# EAGLE design Reflow Panel Rev B (EAGLE 7.6.0)
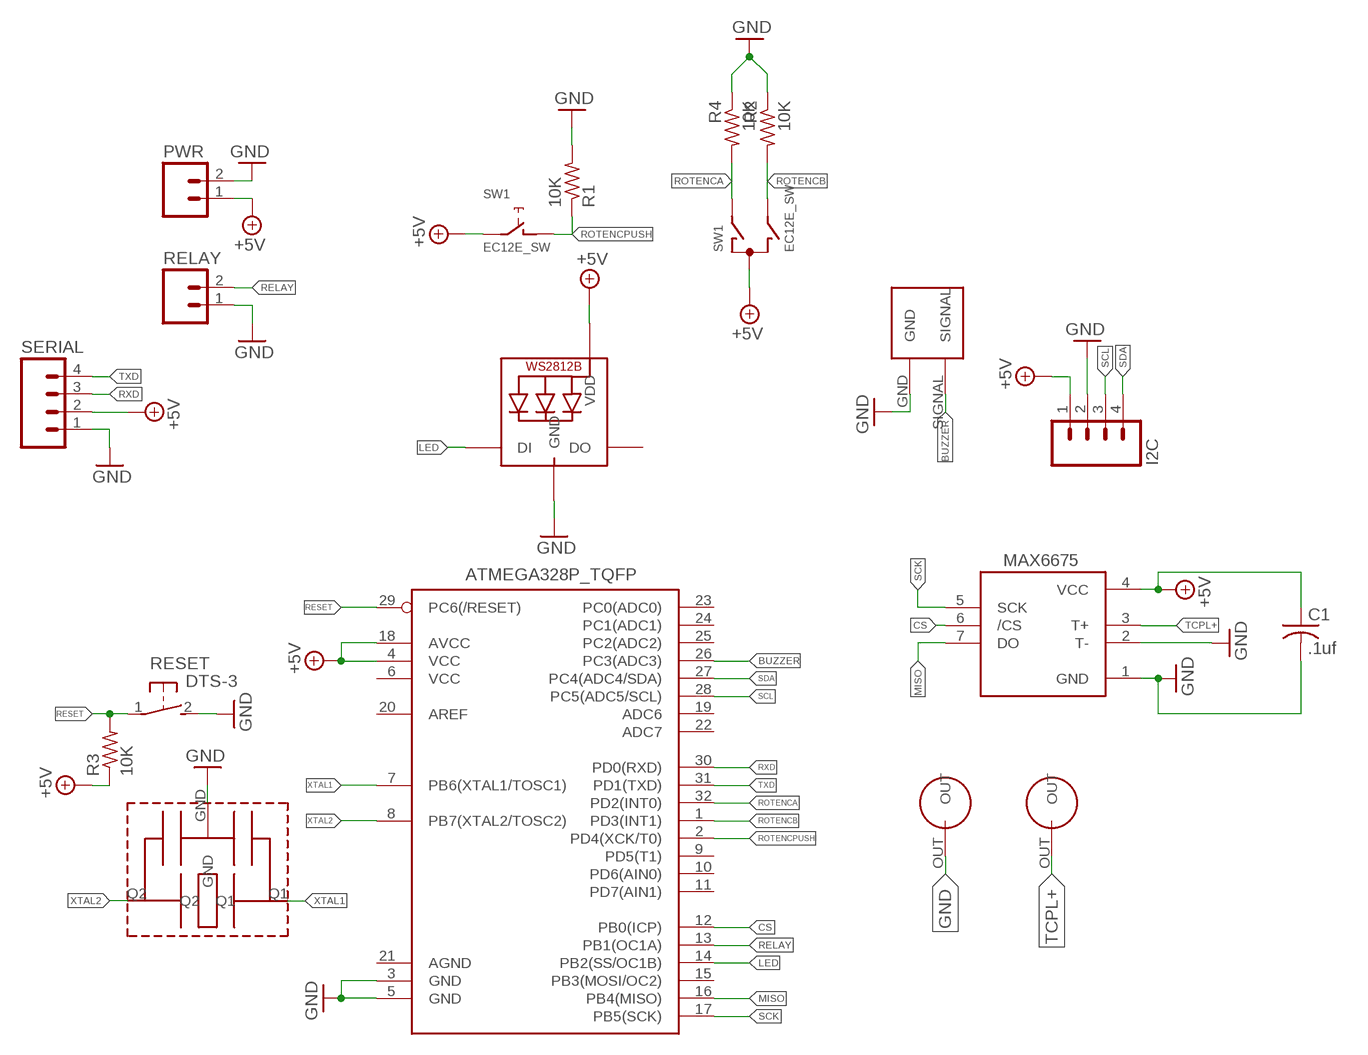
[diagram p0: schematic, sheet 1]

## Parts
C1  .1uf  C-USC0805  [C0805]
I2C  M04LOCK_LONGPADS  [1X04_LOCK_LONGPADS]
IC2  MAX6675  [SO08]
LED1  WS2812B5050  [WS2812B]
PWR  M02LOCK  [1X02_LOCK]
R1  10K  R-US_M0805  [M0805]
R2  10K  R-US_M0805  [M0805]
R3  10K  R-US_M0805  [M0805]
R4  10K  R-US_M0805  [M0805]
RELAY  M02LOCK  [1X02_LOCK]
RESET  DTS-3  [DTS-3]
SERIAL  M04LOCK_LONGPADS  [1X04_LOCK_LONGPADS]
SW1  EC12E_SW  [ALPS_EC12E_SW]
U1  ATMEGA328P_TQFP  [TQFP32-08]
U$1  8.5MMSQUAREBUZZER  [8.5MMSQUAREBUZZER]
U$2  CSTCE16M0V53-R0  [CSTCE_V13C]
U$3  BANANAFEMALE  [BANANAFEMALE]
U$4  BANANAFEMALE  [BANANAFEMALE]

## Nets
+5V: C1.1 I2C.1 IC2.4(VCC) LED1.1-VDD(VDD) PWR.1 R3.1 SERIAL.2 SW1.C SW1.E U1.4(VCC) U1.18(AVCC)
BUZZER: U1.26(PC3(ADC3)) U$1.SIGNAL
CS: IC2.6(/CS) U1.12(PB0(ICP))
GND: C1.2 I2C.2 IC2.1(GND) IC2.2(T-) LED1.3-GND(GND) PWR.2 R1.2 R2.1 R4.1 RELAY.1 RESET.2 SERIAL.1 U1.3(GND) U1.5(GND) U$1.GND U$2.GND U$3.OUT
LED: LED1.4-DIN(DI) U1.14(PB2(SS/OC1B))
MISO: IC2.7(DO) U1.16(PB4(MISO))
RELAY: RELAY.2 U1.13(PB1(OC1A))
RESET: R3.2 RESET.1 U1.29(PC6(/RESET))
ROTENCA: R4.2 SW1.A U1.32(PD2(INT0))
ROTENCB: R2.2 SW1.B U1.1(PD3(INT1))
ROTENCPUSH: R1.1 SW1.D U1.2(PD4(XCK/T0))
RXD: SERIAL.3 U1.30(PD0(RXD))
SCK: IC2.5(SCK) U1.17(PB5(SCK))
SCL: I2C.3 U1.28(PC5(ADC5/SCL))
SDA: I2C.4 U1.27(PC4(ADC4/SDA))
TCPL+: IC2.3(T+) U$4.OUT
TXD: SERIAL.4 U1.31(PD1(TXD))
XTAL1: U1.7(PB6(XTAL1/TOSC1)) U$2.Q1
XTAL2: U1.8(PB7(XTAL2/TOSC2)) U$2.Q2
Unconnected: LED1.2-DOUT(DO) SW1.GND1(G) SW1.GND2(G) U1.6(VCC) U1.9(PD5(T1)) U1.10(PD6(AIN0)) U1.11(PD7(AIN1)) U1.15(PB3(MOSI/OC2)) U1.19(ADC6) U1.20(AREF) U1.21(AGND) U1.22(ADC7) U1.23(PC0(ADC0)) U1.24(PC1(ADC1)) U1.25(PC2(ADC2))

## Library data of the parts
C1 = rcl:C-US: CAPACITOR, American symbol
I2C SERIAL = User-Submitted:M04: Header 4 Standard 4-pin 0.1" header. Use with straight break away headers (SKU : PRT-00116), right angle break away headers (PRT-00553), swiss pins (PRT-00743), machine pins (PRT-00117), and female headers (PRT-00115). Molex polarized connector foot print use with SKU : PRT-08231 with associated crimp pins and housings. 1MM SMD Version SKU: PRT-10208
IC2 = adafruit:MAX6675
LED1 = adafruit:WS2812B
PWR RELAY = SparkFun-Connectors:M02: Standard 2-pin 0.1" header. Use with - straight break away headers ( PRT-00116) - right angle break away headers (PRT-00553) - swiss pins (PRT-00743) - machine pins (PRT-00117) - female headers (PRT-00115) Molex polarized connector foot print use with: PRT-08233 with associated crimp pins and housings. 2.54_SCREWTERM for use with PRT-10571. 3.5mm Screw Terminal footprints for PRT-08084 5mm Screw Terminal footprints for use with PRT-08432
R1-R4 = rcl:R-US_: RESISTOR, American symbol
RESET = switch-tact:DTS-3
SW1 = switch-alps:EC12E_SW: ALPS rotary Encoder EC12E series with switch; MPN: EC12E2424407; OC_FARNELL: 1520813; OC_NEWARK: 74M1068
U1 = SparkFun-DigitalIC:ATMEGA328P_TQFP; PROD_ID: IC-09069
U$1 = custom:8.5MMSQUAREBUZZER
U$2 = custom:CSTCE16M0V53-R0
U$3 U$4 = custom:BANANAFEMALE

## Board
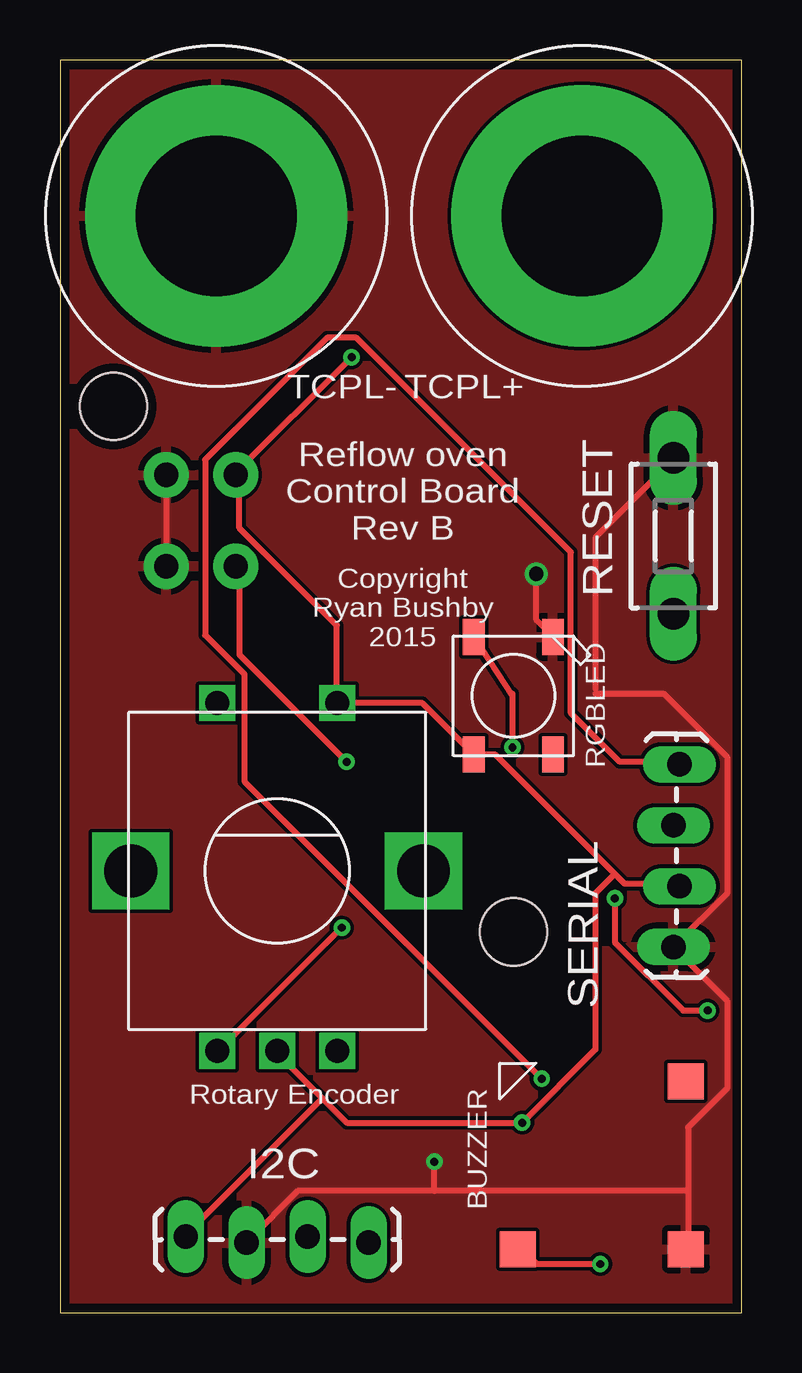
[diagram p1: board, top side]
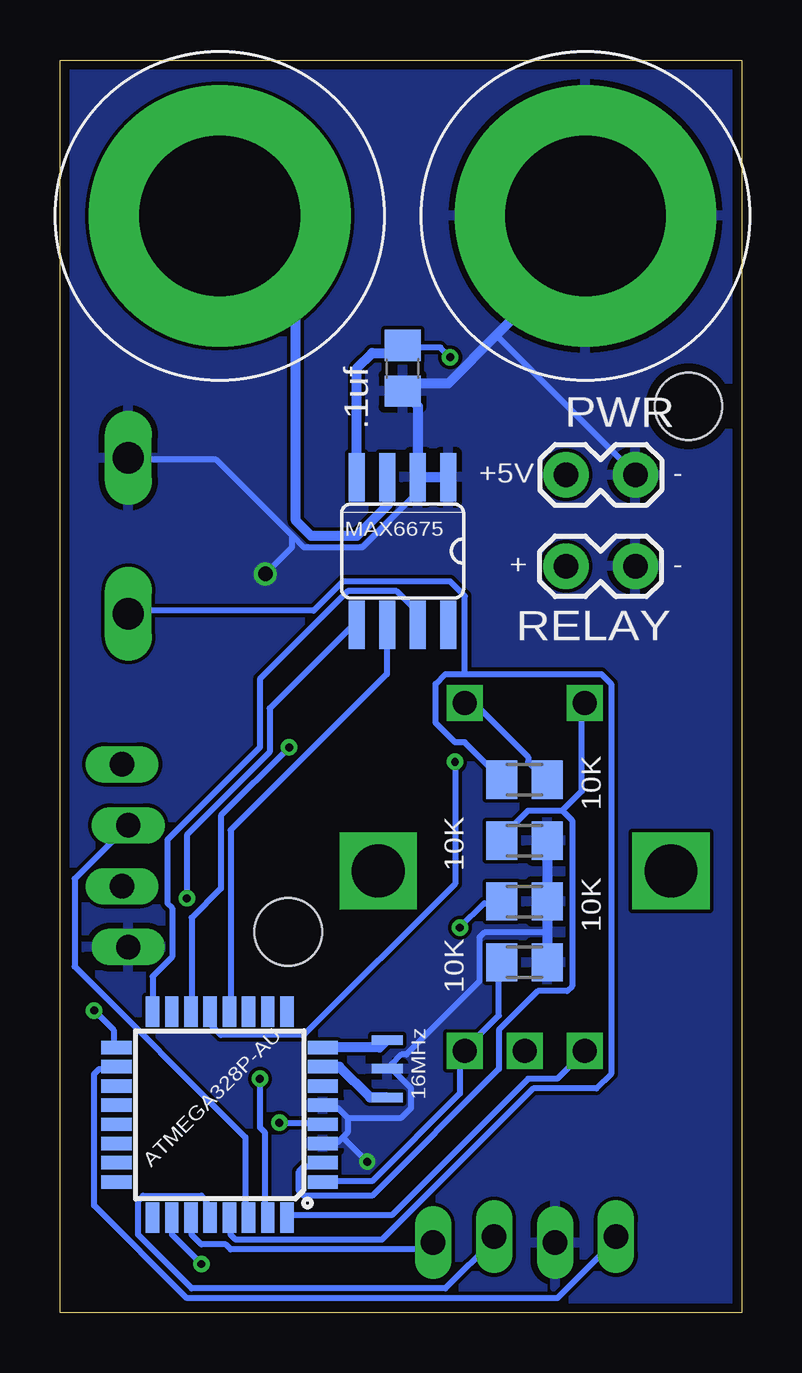
[diagram p2: board, bottom side, seen from below]

Size 28.4 x 52.22 mm. Coordinates in mm from the lower left corner, seen from the top.
Outline: 0,0 28.4,0 28.4,52.22 0,52.22 0,0
Copper layers (1*16): Top 0.0356mm / dielectric 1.5011mm / Bottom 0.0356mm
Design rules "LaenPCBOrder *": minimum track width 10mil, minimum drill 13mil, track to track 6mil, track to pad 6mil, pad to pad 6mil, via to via 6mil, smd to smd 6mil, copper to edge 15mil, drill to drill 6mil, minimum pad ring 7mil, minimum via ring 7mil, stop-mask expansion 3mil, vias tented up to drill 0mil, thermal gap 10mil
Holes 2.8 mm at 2.22,37.78 18.89,15.88

### Footprints (pad centres in the part's own frame; a part is rotated, then mirrored left to right if it is on the bottom)
C0805 = smd 1.3 x 1.5: 1 -0.95,0; 2 0.95,0
1X04_LOCK_LONGPADS = drill 1.016 long: 1 0,0; 2 2.54,-0.254; 3 5.08,0; 4 7.62,-0.254
SO08 = smd 0.66 x 2.032: 1 -1.905,-3.073; 2 -0.635,-3.073; 3 0.635,-3.073; 4 1.905,-3.073; 5 1.905,3.073; 6 0.635,3.073; 7 -0.635,3.073; 8 -1.905,3.073
WS2812B = smd 1.5 x 0.9: 1-VDD 2.45,-1.65; 2-DOUT 2.45,1.65; 3-GND -2.45,1.65; 4-DIN -2.45,-1.65
1X02_LOCK = drill 1.016 pad 1.88: 1 -0.178,0; 2 2.718,0
M0805 = smd 1.3 x 1.6: 1 -0.95,0; 2 0.95,0
DTS-3 = drill 1.3 long: 1 -3.25,0; 2 3.25,0
ALPS_EC12E_SW = drill 1 square: A -2.5,-7.5; B 2.5,-7.5; C 0,-7.5; D -2.5,7; E 2.5,7 | drill 2.2 square: GND1 -6.1,0; GND2 6.1,0
TQFP32-08 = smd 1.27 x 0.559: 1 -4.293,2.8; 2 -4.293,2; 3 -4.293,1.2; 4 -4.293,0.4; 5 -4.293,-0.4; 6 -4.293,-1.2; 7 -4.293,-2; 8 -4.293,-2.8; 17 4.293,-2.8; 18 4.293,-2; 19 4.293,-1.2; 20 4.293,-0.4; 21 4.293,0.4; 22 4.293,1.2; 23 4.293,2; 24 4.293,2.8 | smd 0.559 x 1.27: 9 -2.8,-4.293; 10 -2,-4.293; 11 -1.2,-4.293; 12 -0.4,-4.293; 13 0.4,-4.293; 14 1.2,-4.293; 15 2,-4.293; 16 2.8,-4.293; 25 2.8,4.293; 26 2,4.293; 27 1.2,4.293; 28 0.4,4.293; 29 -0.4,4.293; 30 -1.2,4.293; 31 -2,4.293; 32 -2.8,4.293
8.5MMSQUAREBUZZER = smd 1.5 x 1.5: GND 8.14,0.75; P$3 8.14,7.75; SIGNAL 1.14,0.75
CSTCE_V13C = smd 0.4 x 1.3: GND 0.01,0.01; Q1 -1.19,0.01; Q2 1.21,0.01
BANANAFEMALE = drill 6.7 pad 10.9: OUT 0,0

### Placement (x,y rotation side)
C1  14.13,39.37 270 bottom
I2C  5.24,3.17 0 top
IC2  14.13,31.75 180 bottom
LED1  18.89,25.72 270 top
PWR  7.14,34.92 0 bottom
R1  9.05,19.68 0 bottom
R2  9.05,14.61 180 bottom
R3  9.05,22.23 180 bottom
R4  9.05,17.14 180 bottom
RELAY  4.6,31.11 180 bottom
RESET  25.56,32.38 90 top
SERIAL  25.56,15.24 90 top
SW1  9.05,18.41 0 top
U1  21.75,8.26 180 bottom
U$1  17.94,1.91 0 top
U$2  14.76,10.16 90 bottom
U$3  6.51,45.72 0 top
U$4  21.75,45.72 0 top

### Tracks (layer width: path | path; a pad name or v marks a point on that pad's centre or on a via)
+5V  (via drill 0.33)
  Top 0.254: 10.93,8.94 9.1,10.77 SW1.C | 10.93,8.94 11.94,7.92 v19.26,7.92 22.31,10.97 22.31,17.48 23.12,18.29 | 10.93,8.94 5.24,3.25 I2C.1 | 23.12,18.29 23.53,17.88 25.76,17.88 SERIAL.2 | 23.12,18.29 18.14,23.27 LED1.1-VDD 15.09,25.41 SW1.E | SW1.E 11.54,25.6 11.54,28.65 7.47,32.72 7.47,34.75 PWR.1 7.27,34.95 v12.15,39.83 | 11.74,25.4 SW1.E
  Bottom 0.254: v19.26,7.92 17.63,7.92 U1.4 | U1.18 26.17,10.16 26.78,10.16 26.98,9.96 26.98,4.47 23.12,0.61 7.68,0.61 5.24,3.05 I2C.1 | R3.1 8.29,22.35 8.9,22.96 8.9,23.16 11.13,25.4 11.54,25.4 SW1.E | v12.15,39.83 12.55,40.23 13.98,40.23 C1.1
  Bottom 0.406: IC2.4 16.03,39.37 15.4,40.01 14.44,40.01 C1.1
BUZZER  (via drill 0.33)
  Top 0.254: v22.51,2.03 19.87,2.03 19.26,2.64 U$1.SIGNAL
  Bottom 0.254: v22.51,2.03 23.73,3.25 23.73,3.86 U1.26
CS
  Bottom 0.254: U1.12 21.29,12.6 21.29,20.12 14.79,26.62 14.79,28.65 IC2.6
GND  (via drill 0.33, 0.6)
  Top 0.254: 26.17,5.08 26.17,7.72 27.79,9.35 27.79,13.01 SERIAL.1 27.79,17.48 27.79,23.16 25.15,25.81 22.31,25.81 | 26.17,5.08 26.17,2.85 U$1.GND | 26.17,5.08 15.6,5.08 | 15.6,5.08 9.91,5.08 7.88,3.05 I2C.2 | 15.6,5.08 v15.6,6.3 | 22.31,26.01 22.31,32.31 25.56,35.56 RESET.2 | PWR.2 RELAY.1 | LED1.3-GND 19.84,28.86 v19.84,30.8
  Bottom 0.254: 16.62,7.32 16.41,7.52 16.41,8.13 | 16.62,7.32 16.82,7.11 17.43,7.11 U1.3 | 16.41,8.13 16.82,8.53 17.43,8.53 U1.5 | 16.41,8.13 14.18,8.13 13.77,8.53 13.77,9.35 14.59,10.16 U$2.GND 14.59,10.36 14.18,10.77 13.98,10.77 10.93,13.82 10.93,15.65 10.72,15.85 8.1,15.85 | v15.6,6.3 16.62,7.32 | 10.22,40.74 4.43,34.95 PWR.2 | 18.73,32.39 18.24,31.9 15.8,31.9 13.57,34.14 13.57,34.75 IC2.2 | 18.73,32.39 21.9,35.56 25.56,35.56 RESET.2 | v19.84,30.8 18.73,31.91 18.73,32.39
  Bottom 0.406: IC2.1 IC2.2 13.49,37.78 C1.2 13.81,38.73 12.22,38.73 10.22,40.74 6.51,44.45 U$3.OUT | R1.2 R4.1 8.1,15.85 R2.1
  pour Bottom: 0,52.07 28.73,52.07 28.73,0 0,-0.16
  pour Top: -0.32,52.23 28.42,52.23 28.42,0 -0.32,0
LED  (via drill 0.33)
  Top 0.254: 18.85,25.81 18.85,25.72 | 18.85,25.72 v18.85,23.57 | LED1.4-DIN 18.85,25.72
  Bottom 0.254: v18.85,23.57 21.7,20.73 21.7,17.68 22.92,16.46 22.92,12.6 U1.14
MISO
  Bottom 0.254: U1.16 24.54,12.6 24.54,14.02 23.73,14.83 23.73,16.87 23.93,17.07 23.93,19.71 20.07,23.57 20.07,26.42 16.41,30.07 14.38,30.07 13.57,29.26 13.57,28.85 IC2.7
RELAY  (via drill 0.33)
  Top 0.254: v11.94,22.96 7.47,27.43 7.47,31.09 RELAY.2
  Bottom 0.254: v11.94,22.96 11.94,17.88 18.24,11.58 21.7,11.58 22.1,11.99 22.1,12.39 U1.13
RESET
  Bottom 0.254: 11.54,26.62 12.35,26.62 12.76,26.21 12.76,24.59 11.94,23.77 11.54,23.77 10.12,22.35 R3.2 | 11.54,26.62 5.85,26.62 5.44,26.21 5.44,9.96 6.05,9.35 8.69,9.35 14.99,3.05 21.09,3.05 21.29,3.25 21.29,3.86 U1.29 | 11.54,26.62 11.54,29.87 12.15,30.48 16.62,30.48 17.84,29.26 25.56,29.26 RESET.1
ROTENCA  (via drill 0.33)
  Top 0.254: v11.74,16.05 6.66,10.97 SW1.A
  Bottom 0.254: U1.32 18.85,4.06 14.59,4.06 8.9,9.75 7.68,9.75 6.66,10.77 SW1.A | v11.74,16.05 10.72,17.07 10.12,17.07 R4.2
ROTENCB
  Bottom 0.254: U1.1 17.43,5.49 15.4,5.49 11.74,9.14 11.74,10.77 SW1.B 11.54,10.97 10.12,12.39 10.12,14.43 R2.2
ROTENCPUSH
  Bottom 0.254: 7.47,20.93 7.07,20.52 7.07,13.61 7.27,13.41 8.49,13.41 10.12,11.79 10.12,10.16 15.4,4.88 18.24,4.88 18.45,5.08 18.45,5.89 18.24,6.1 17.63,6.1 U1.2 | 7.47,20.93 8.9,20.93 10.12,19.71 R1.1 | 7.47,20.93 6.66,21.74 6.66,25.4 SW1.D
RXD
  Bottom 0.254: SERIAL.3 27.79,18.09 27.79,14.43 20.68,7.32 20.68,4.06 U1.30
SCK  (via drill 0.33)
  Top 0.254: v26.98,12.6 25.96,12.6 23.12,15.44 v23.12,17.27
  Bottom 0.254: v26.98,12.6 26.17,11.79 26.17,11.18 U1.17 | v23.12,17.27 23.12,19.91 19.67,23.37 19.67,25.2 16.21,28.65 IC2.5
SCL
  Bottom 0.254: U1.28 22.31,4.06 22.31,4.67 22.51,4.88 24.95,4.88 25.15,4.67 25.15,3.25 22.92,1.02 12.35,1.02 10.32,3.05 I2C.3
SDA
  Bottom 0.254: U1.27 22.92,3.86 22.92,3.25 22.51,2.85 21.5,2.85 21.29,2.64 13.16,2.64 12.96,2.85 I2C.4
TCPL+
  Bottom 0.406: IC2.3 14.76,33.66 16.03,32.38 17.94,32.38 18.57,33.02 18.57,42.55 U$4.OUT
TXD  (via drill 0.33)
  Top 0.254: v20.07,9.75 7.68,22.15 7.68,26.62 6.05,28.25 6.05,35.56 11.13,40.64 12.35,40.64 21.29,31.7 21.29,24.99 23.32,22.96 25.76,22.96 SERIAL.4
  Bottom 0.254: v20.07,9.75 20.07,7.72 19.87,7.52 19.87,4.06 U1.31
XTAL1
  Bottom 0.406: U$2.Q1 15.48,8.97 16.76,10.26 U1.7
XTAL2
  Bottom 0.406: U$2.Q2 15.09,11.05 U1.8

### Text on the board
tNames: TCPL- | TCPL+ | Reflow oven / Control Board / Rev B | Copyright / Ryan Bushby / 2015 | RGBLED | Rotary Encoder | BUZZER
bNames: - | +5V | - | + | 16MHz | ATMEGA328P-AU